# EAGLE schematic bird_beaks 2.0 (EAGLE 9.6.2)
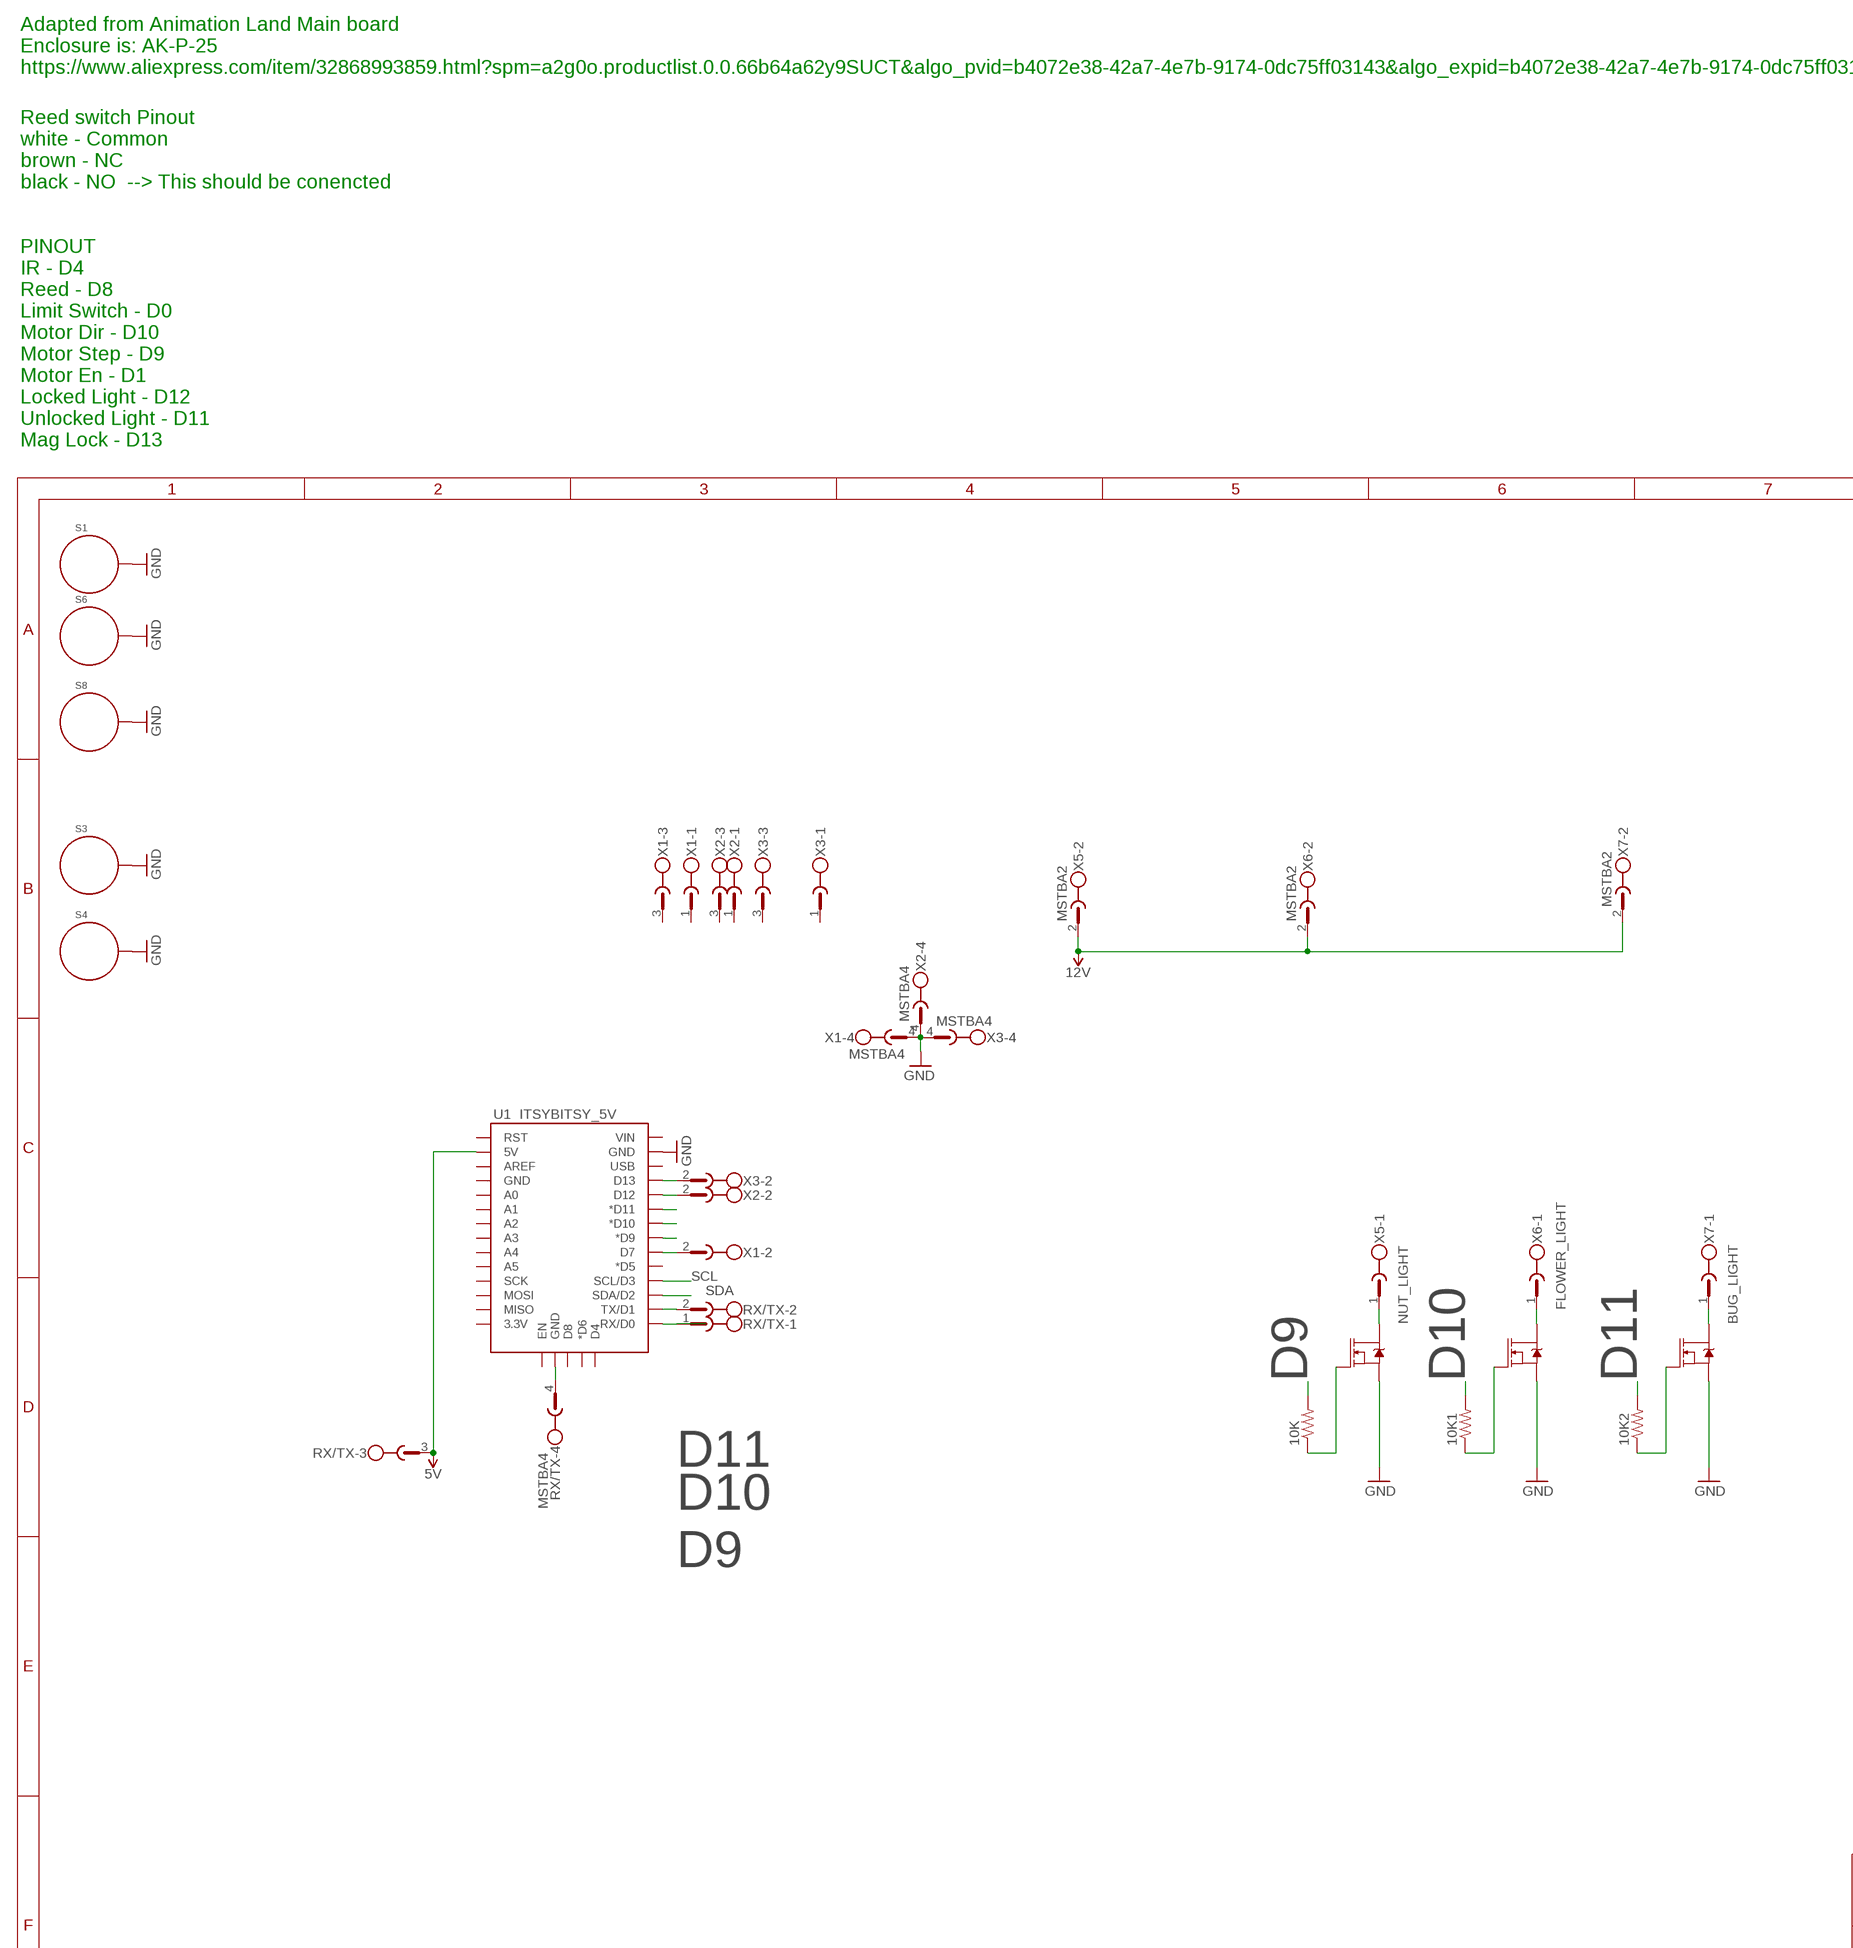
[diagram p0: schematic, sheet 1, part 1 of 2]
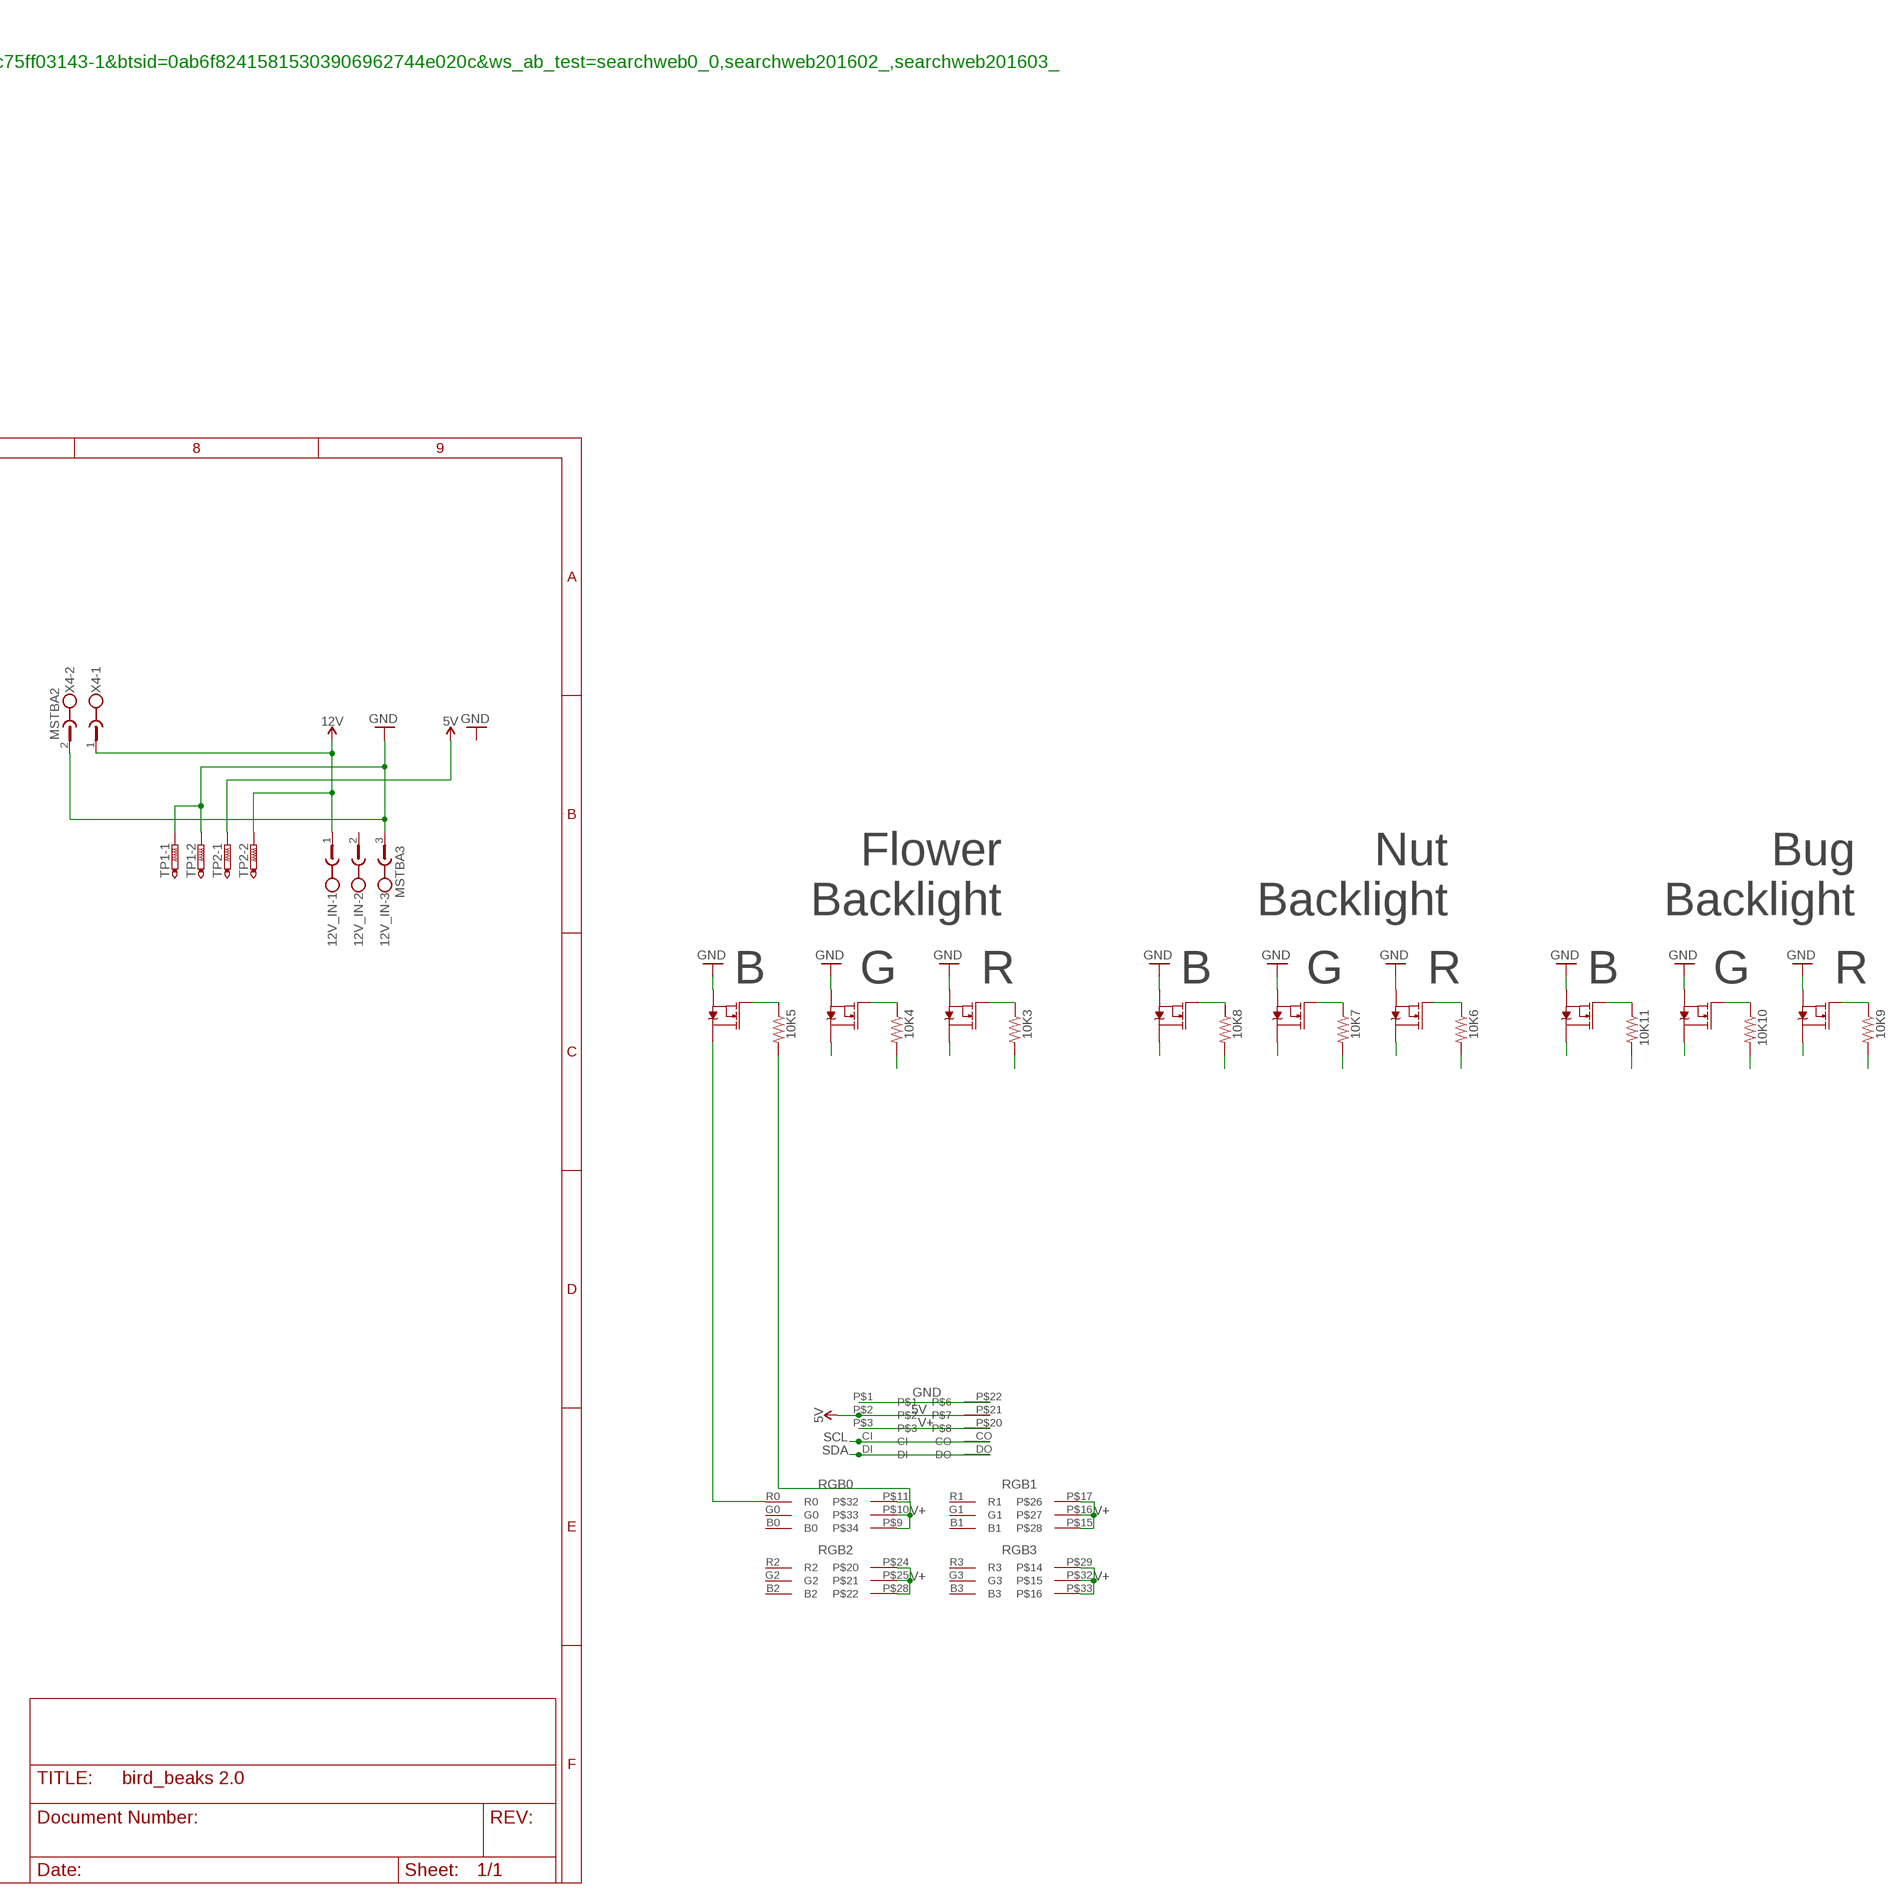
[diagram p1: schematic, sheet 1, part 2 of 2]

## Parts
10K  R-US_M0805  [M0805]
10K1  R-US_M0805  [M0805]
10K2  R-US_M0805  [M0805]
10K3  R-US_M0805  [M0805]
10K4  R-US_M0805  [M0805]
10K5  R-US_M0805  [M0805]
10K6  R-US_M0805  [M0805]
10K7  R-US_M0805  [M0805]
10K8  R-US_M0805  [M0805]
10K9  R-US_M0805  [M0805]
10K10  R-US_M0805  [M0805]
10K11  R-US_M0805  [M0805]
12V_IN  MSTBA3  [MSTBA3]
Q1  MOSFET-NCH  [SO-8_POWER_PAK]
Q2  MOSFET-NCH  [SO-8_POWER_PAK]
Q3  MOSFET-NCH  [SO-8_POWER_PAK]
Q4  MOSFET-NCH  [SO-8_POWER_PAK]
Q5  MOSFET-NCH  [SO-8_POWER_PAK]
Q6  MOSFET-NCH  [SO-8_POWER_PAK]
Q7  MOSFET-NCH  [SO-8_POWER_PAK]
Q8  MOSFET-NCH  [SO-8_POWER_PAK]
Q9  MOSFET-NCH  [SO-8_POWER_PAK]
Q10  MOSFET-NCH  [SO-8_POWER_PAK]
Q11  MOSFET-NCH  [SO-8_POWER_PAK]
Q12  MOSFET-NCH  [SO-8_POWER_PAK]
RX/TX  MSTBA4  [MSTBA4]
S1  STANDOFF_ELECTRICAL5-32  [STANDOFF_ELECTRICAL_5_32]
S3  STANDOFF_ELECTRICAL5-32  [STANDOFF_ELECTRICAL_5_32]
S4  STANDOFF_ELECTRICAL5-32  [STANDOFF_ELECTRICAL_5_32]
S6  STANDOFF_ELECTRICAL5-32  [STANDOFF_ELECTRICAL_5_32]
S8  STANDOFF_ELECTRICAL5-32  [STANDOFF_ELECTRICAL_5_32]
TP1  PTR2  [P2-38-17]
TP2  PTR2  [P2-38-17]
U1  ITSYBITSY_5V  [ADAFRUIT_LENOARDO]
U$1  TLC59711  [ADAFRUIT_TLC59711]
X1  MSTBA4  [MSTBA4]
X2  MSTBA4  [MSTBA4]
X3  MSTBA4  [MSTBA4]
X4  MSTBA2  [MSTBA2]
X5  MSTBA2  [MSTBA2]
X6  MSTBA2  [MSTBA2]
X7  MSTBA2  [MSTBA2]

## Nets
5V [High Power]: RX/TX.3 TP2.TP-1 U1.5V U$1.P$2 U$1.P$21
12V [High Power]: 12V_IN.1 TP2.TP-2 X4.1 X5.2 X6.2 X7.2
BUG_LIGHT: Q3.D1(D) X7.1
D1: 10K3.2
D2: 10K4.2
D4: 10K6.2
D5: 10K7.2
D6: 10K8.2
D7: U1.D7 X1.2
D8: 10K9.2
D9: 10K.2 U1.D9(*D9)
D10: 10K1.2 U1.D10(*D10)
D11: 10K2.2 U1.D11(*D11)
D12: U1.D12 X2.2
D13: U1.D13 X3.2
D14: 10K10.2
D15: 10K11.2
FLOWER_LIGHT: Q2.D1(D) X6.1
GND [High Power]: 12V_IN.3 Q1.S Q2.S Q3.S Q4.S Q5.S Q6.S Q7.S Q8.S Q9.S Q10.S Q11.S Q12.S S1.P1 S3.P1 S4.P1 S6.P1 S8.P1 TP1.TP-1 TP1.TP-2 U1.GND@2(GND) U$1.P$1 U$1.P$22 X1.4 X2.4 X3.4 X4.2
N$1: 10K2.1 Q3.G
N$2: 10K.1 Q1.G
N$3: RX/TX.4 U1.GND@1(GND)
N$4: 10K3.1 Q4.G
N$5: Q4.D1(D)
N$6: 10K4.1 Q5.G
N$7: 10K1.1 Q2.G
N$8: RX/TX.2 U1.TX(TX/D1)
N$9: Q5.D1(D)
N$11: RX/TX.1 U1.RX(RX/D0)
N$12: 10K5.1 Q6.G
N$13: Q6.D1(D) U$1.R0
N$14: 10K6.1 Q7.G
N$15: Q7.D1(D)
N$16: 10K7.1 Q8.G
N$17: Q8.D1(D)
N$18: 10K8.1 Q9.G
N$19: Q9.D1(D)
N$20: 10K9.1 Q10.G
N$21: Q10.D1(D)
N$22: 10K10.1 Q11.G
N$23: Q11.D1(D)
N$24: 10K11.1 Q12.G
N$25: Q12.D1(D)
NUT_LIGHT: Q1.D1(D) X5.1
SCL: U1.SCL(SCL/D3) U$1.CI U$1.CO
SDA: U1.SDA(SDA/D2) U$1.DI U$1.DO
V+: 10K5.2 U$1.P$3 U$1.P$9 U$1.P$10 U$1.P$11 U$1.P$15 U$1.P$16 U$1.P$17 U$1.P$20 U$1.P$24 U$1.P$25 U$1.P$28 U$1.P$29 U$1.P$32 U$1.P$33
Unconnected: 12V_IN.2 U1.3V(3.3V) U1.A0 U1.A1 U1.A2 U1.A3 U1.A4 U1.A5 U1.AREF U1.D4 U1.D5(*D5) U1.D6(*D6) U1.D8 U1.EN U1.GND@0(GND) U1.MISO U1.MOSI U1.RES(RST) U1.SCK U1.USB U1.VIN U$1.B0 U$1.B1 U$1.B2 U$1.B3 U$1.G0 U$1.G1 U$1.G2 U$1.G3 U$1.R1 U$1.R2 U$1.R3 X1.1 X1.3 X2.1 X2.3 X3.1 X3.3

## Notes on the sheet
- Adapted from Animation Land Main board
  Enclosure is: AK-P-25
  https://www.aliexpress.com/item/32868993859.html?spm=a2g0o.productlist.0.0.66b64a62y9SUCT&algo_pvid=b4072e38-42a7-4e7b-9174-0dc75ff03143&algo_expid=b4072e38-42a7-4e7b-9174-0dc75ff03143-1&btsid=0ab6f82415815303906962744e020c&ws_ab_test=searchweb0_0,searchweb201602_,searchweb201603_
- Reed switch Pinout
  white - Common
  brown - NC
  black - NO  --> This should be conencted
  
  
  PINOUT
  IR - D4
  Reed - D8
  Limit Switch - D0
  Motor Dir - D10
  Motor Step - D9
  Motor En - D1
  Locked Light - D12
  Unlocked Light - D11
  Mag Lock - D13
- Flower
  Backlight
- Nut
  Backlight
- Bug
  Backlight
- B | G | R | B | G | R | B | G | R

## Library data of the parts
10K 10K1-10K11 = adafruit:R-US_: RESISTOR, American symbol
12V_IN = con-phoenix-508:MSTBA3: PHOENIX; MF: FARNELL; MPN: 1757255; OC_FARNELL: 3705183; OC_NEWARK: 71C4162
Q1-Q12 = th_ds_libraries:MOSFET-NCH: N-channel MOSFETs from Sparkfun-DiscreteSemi Library
RX/TX = th_libraries:MSTBA4: PHOENIX; MF: FARNELL; MPN: 1757268; OC_FARNELL: 3705195; OC_NEWARK: 71C4163
S1 S3 S4 S6 S8 = th_libraries:STANDOFF_ELECTRICAL: A standoff intended to be an electrically connected point. Pad size and stop size allow for a #8 Phillips pan screw head to make a solid connection to the board. Added 144mill drill hole that fits my normal wood screw
TP1 TP2 = testpad:PTR2: TEST PIN
U1 = th_ds_libraries:ITSYBITSY_5V: Adafruit ItsyBitsy 32u4 - 5V 16MHz https://www.adafruit.com/product/3677
U$1 = OMSI_Default_V1:TLC59711
X1-X3 = con-phoenix-508:MSTBA4: PHOENIX; MF: FARNELL; MPN: 1757268; OC_FARNELL: 3705195; OC_NEWARK: 71C4163
X4-X7 = con-phoenix-508:MSTBA2: PHOENIX; MF: FARNELL; MPN: 1757242; OC_FARNELL: 3705171; OC_NEWARK: 71C4161

## Net classes
1 High Power: width 0.406 mm, drill 0.483 mm